# Altium schematic sheet MAIN_POWER.SchDoc
size A3; DocumentNumber: 1; SheetNumber: 1; SheetTotal: 3
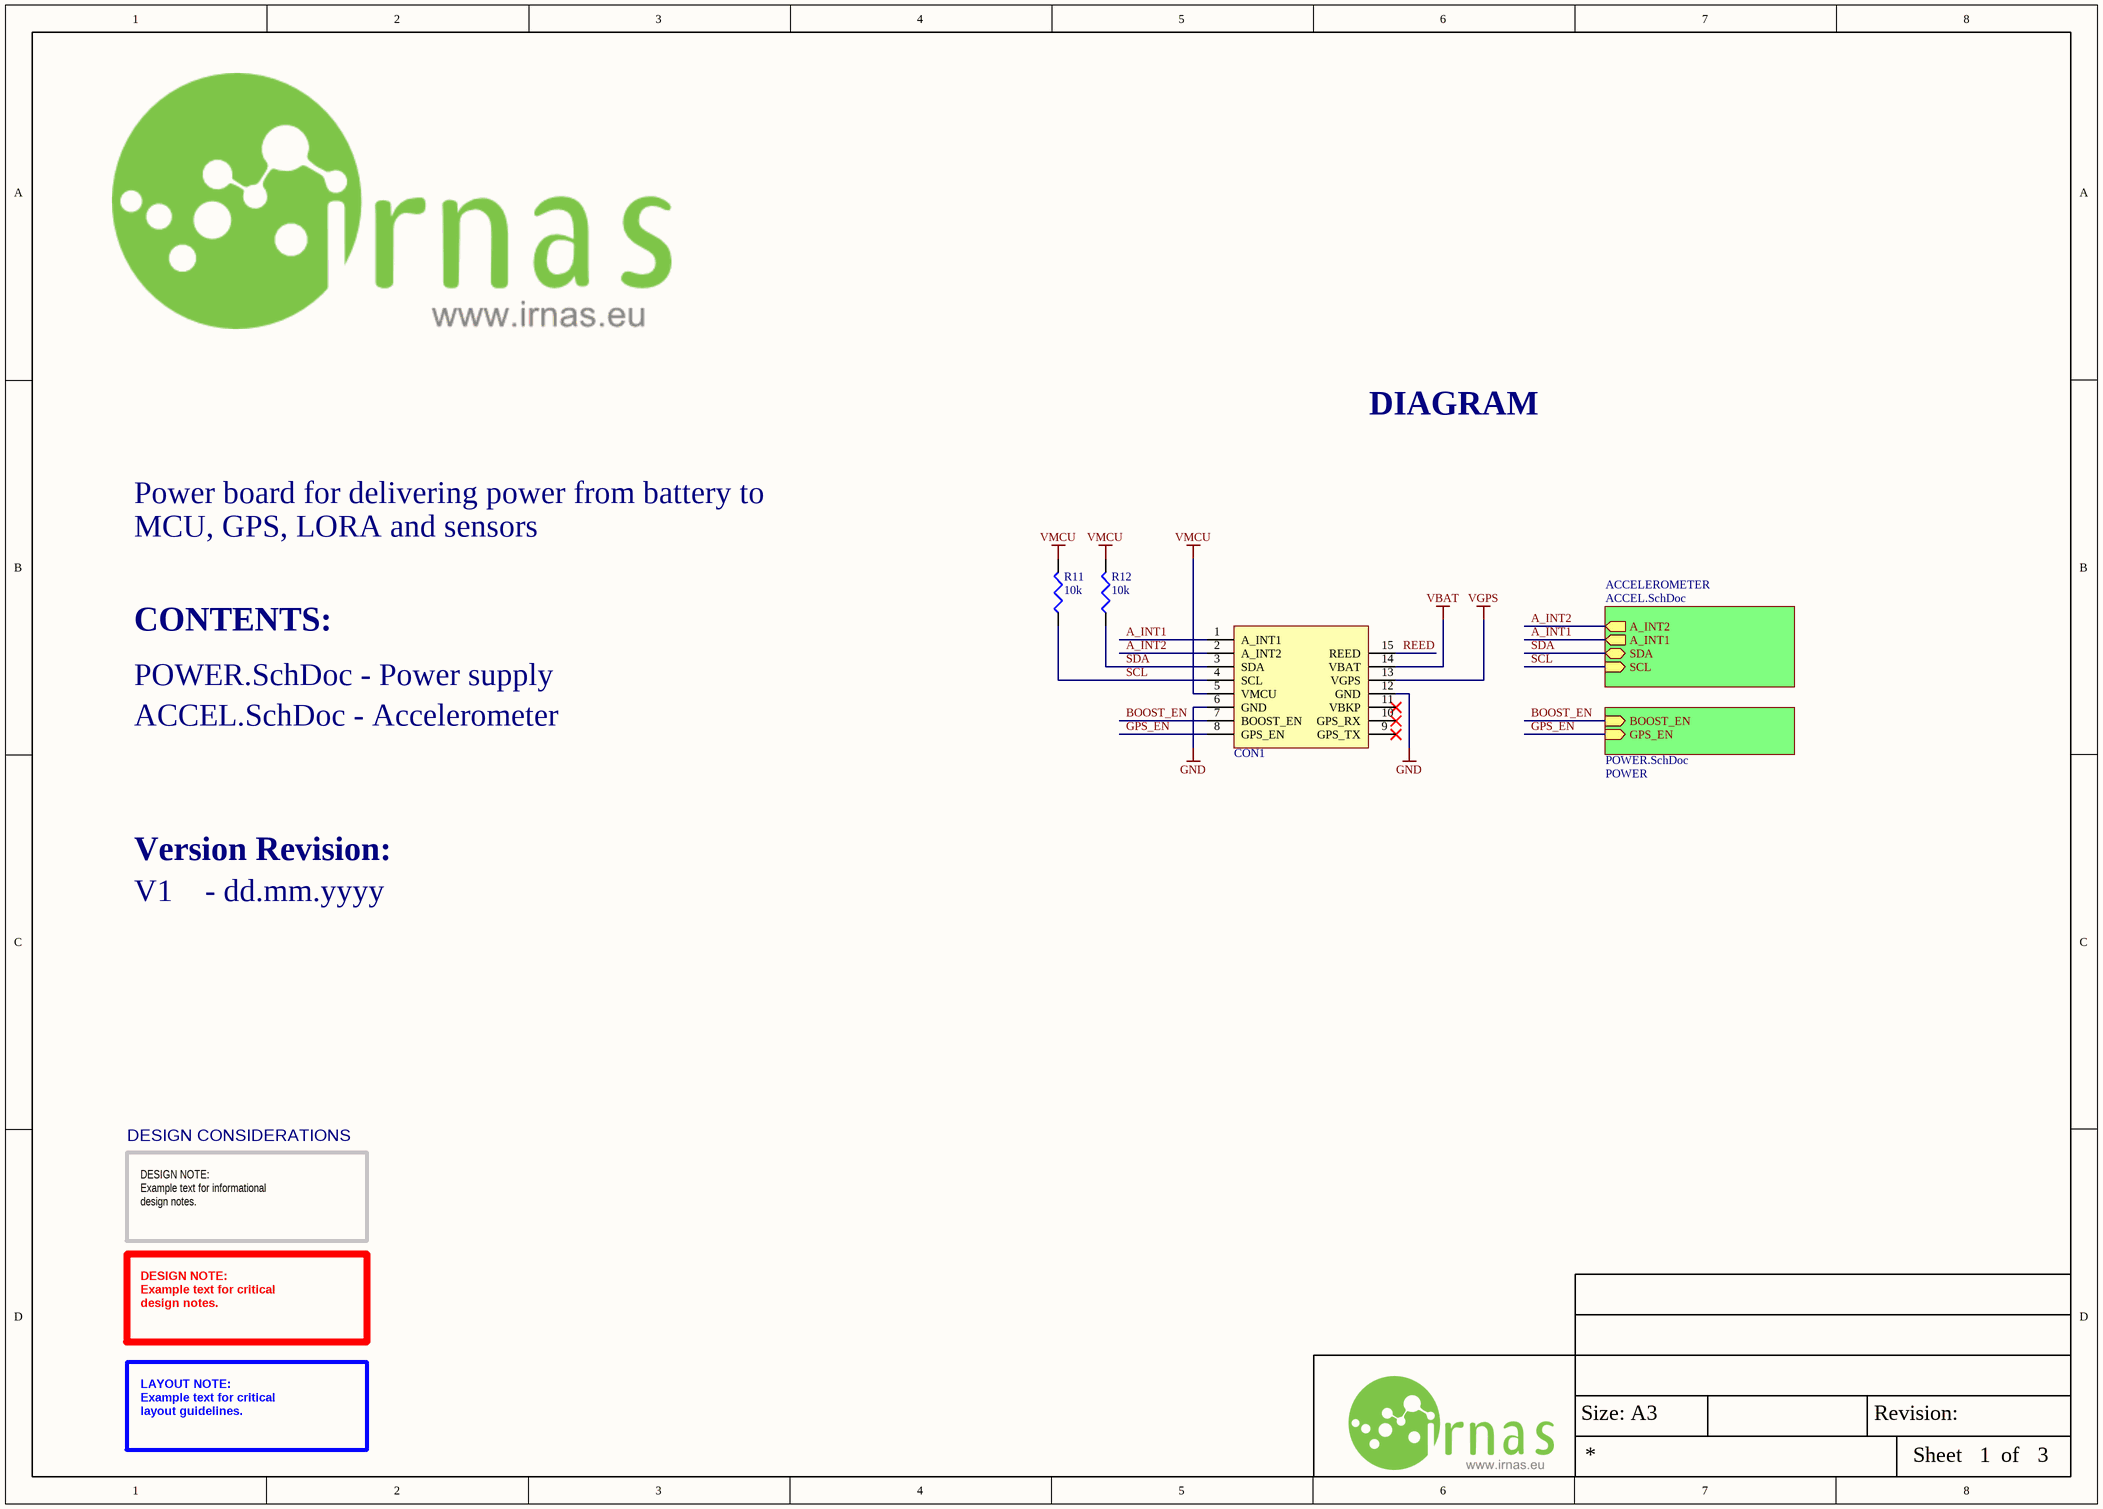
[diagram p0: MAIN_POWER.SchDoc]

## Parts
CON1  Between PCB connection  [SmartParks_Rhino]  (value not drawn)
R11  10k  [RES0402]
R12  10k  [RES0402]

## Sub-sheets
ACCELEROMETER = ACCEL.SchDoc: A_INT1 (out), SCL (in), SDA (bidir), A_INT2 (out)
POWER = POWER.SchDoc: GPS_EN (in), BOOST_EN (in)

## Nets
GND: CON1.6(GND) CON1.12(GND)
VBAT: CON1.14(VBAT)
VGPS: CON1.13(VGPS)
VMCU: CON1.5(VMCU) R11.2 R12.2
A_INT1: CON1.1(A_INT1) ; sheet ACCELEROMETER/A_INT1
A_INT2: CON1.2(A_INT2) ; sheet ACCELEROMETER/A_INT2
BOOST_EN: CON1.7(BOOST_EN) ; sheet POWER/BOOST_EN
GPS_EN: CON1.8(GPS_EN) ; sheet POWER/GPS_EN
REED: CON1.15(REED)
SCL: CON1.4(SCL) R11.1 ; sheet ACCELEROMETER/SCL
SDA: CON1.3(SDA) R12.1 ; sheet ACCELEROMETER/SDA

Not connected (* = marked no-connect by the designer): CON1 9(GPS_TX)* 10(GPS_RX)* 11(VBKP)*

## Notes on the sheet
- DIAGRAM
- Power board for delivering power from battery to
- MCU, GPS, LORA and sensors
- CONTENTS:
- POWER.SchDoc - Power supply
- ACCEL.SchDoc - Accelerometer
- Version Revision:
- V1    - dd.mm.yyyy
- DESIGN CONSIDERATIONS
- DESIGN NOTE:
  Example text for informational
  design notes.
- DESIGN NOTE:
  Example text for critical
  design notes.
- LAYOUT NOTE:
  Example text for critical
  layout guidelines.
- Size: A3
- Revision:
- Sheet
- of

## Library data of the parts
CON1 = SmartParks_Rhino
R11 R12 = R - 10k/0402: MULTICOMP         MCWR04X1002FTL             SMD Chip Resistor, Thick Film, 10 kohm, 50 V, 0402 [1005 Metric], 62.5 mW,  1%, MCWR Series; IRNAS Part No.: I-100014; Resistance: 10kR; Voltage Rating: 50V; Power Rating: 62.5mW; Temperature Coefficient: 100ppm/°C; Supplier 1: Farnell; Manufacturer: Multicomp; Manufacturer Part Number: MCWR04X1002FTL; Stock 1: 602609; Pricing 1: 10=0.0029, 100=0.0017, 500=0.0012, 2500=0.001, 5000=0.0008 (EUR); Case/Package: 0402; Case Code (Metric): 1005; Case Code (Imperial): 0402; Packaging: Cut Tape; Composition: Thick Film; Tolerance: 1%; Voltage Rating (DC): 50V; REACH SVHC: No SVHC; ComponentLink1URL: http://www.farnell.com/datasheets/1849611.pdf; ComponentLink1Description: http://www.farnell.com/datasheets/1849611.pdf; Supplier Part Number 1: 2447096